# Altium schematic sheet MAZ000171 - Diagrama eléctrico.SchDoc: MAZ000171 - Diagrama eléctrico
size A; ApprovedBy: Christian Ledwidth; CheckedBy: Nahuel Martinez; Author: Santiago Marti; CompanyName: Body Health; DrawnBy: Santiago Marti; Revision: A; SheetNumber: 1; SheetTotal: 2
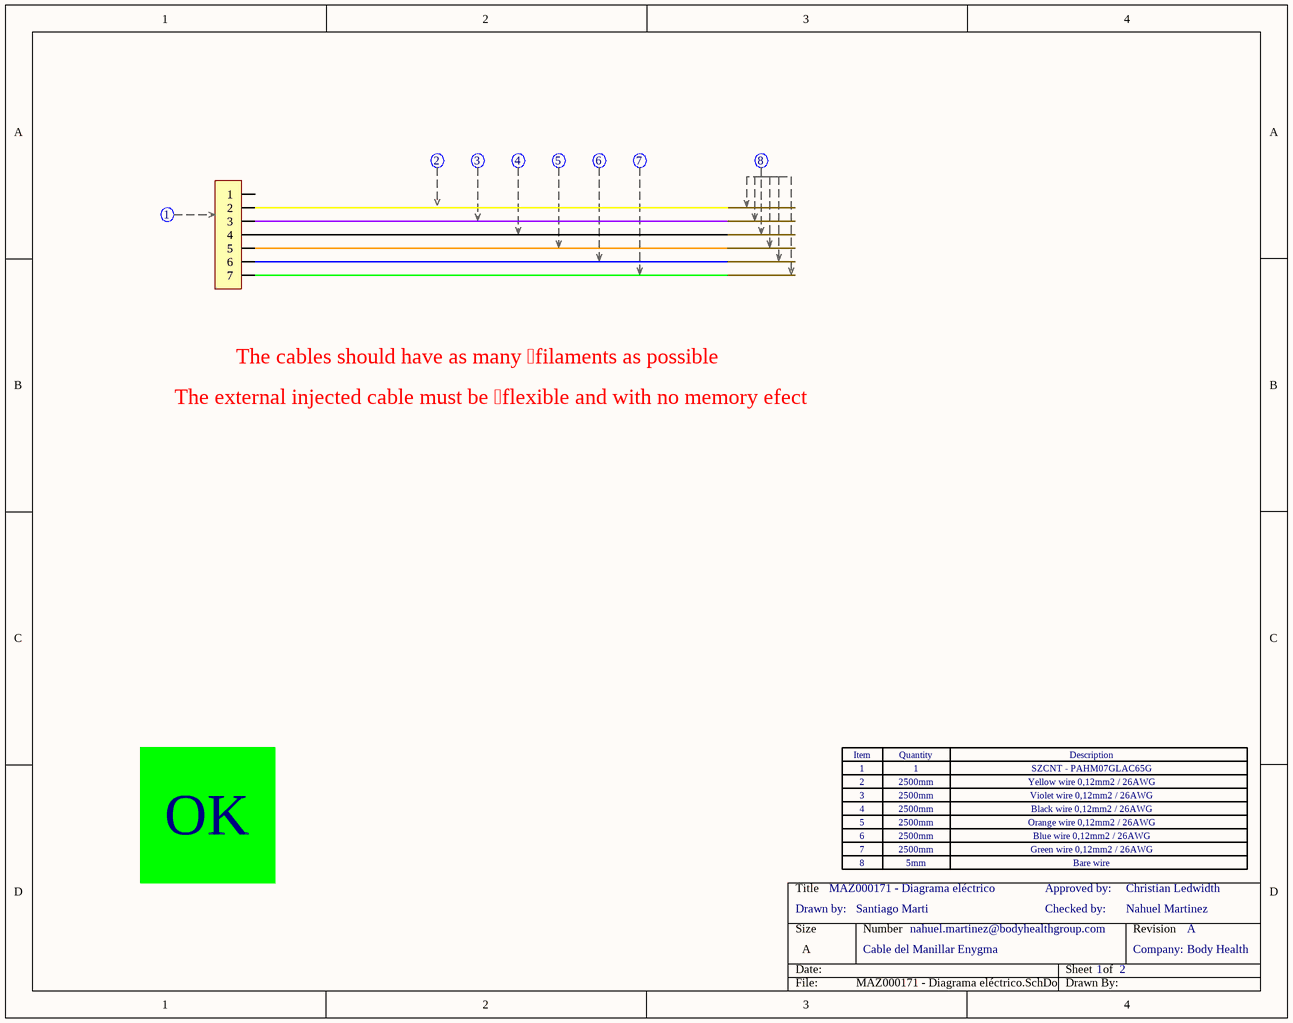
[diagram p0: MAZ000171 - Diagrama eléctrico.SchDoc]

## Parts
Conn1  SZCNT_07_Macho  (value not drawn)  (part C of 3)
Conn2  SZCNT_07_Macho  (value not drawn)  (part B of 3)
Conn3  SZCNT_07_Macho  (value not drawn)  (part B of 3)
Conn4  SZCNT_07_Macho  (value not drawn)  (part B of 3)
Conn5  SZCNT_07_Macho  (value not drawn)  (part B of 3)
Conn6  SZCNT_07_Macho  (value not drawn)  (part B of 3)
Conn7  SZCNT_07_Macho  (value not drawn)  (part B of 3)
Conn8  SZCNT_07_Macho  (value not drawn)  (part B of 3)
Conn9  SZCNT_07_Macho  (value not drawn)  (part B of 3)
Zoc1  Zócalo_Header  (value not drawn)
Zoc2  Zócalo_Item  (value not drawn)
Zoc3  Zócalo_Item  (value not drawn)
Zoc4  Zócalo_Item  (value not drawn)
Zoc5  Zócalo_Item  (value not drawn)
Zoc6  Zócalo_Item  (value not drawn)
Zoc7  Zócalo_Item  (value not drawn)
Zoc8  Zócalo_Item  (value not drawn)
Zoc9  Zócalo_Item  (value not drawn)

## Nets

Not connected (* = marked no-connect by the designer): Conn1 1 2 3 4 5 6 7

## Notes on the sheet
- The cables should have as many filaments as possible
- The external injected cable must be flexible and with no memory efect
- 1
- 2
- 2500mm
- SZCNT - PAHM07GLAC65G
- Yellow wire 0,12mm2 / 26AWG
- OK
- 3
- 4
- 5
- 6
- Violet wire 0,12mm2 / 26AWG
- Black wire 0,12mm2 / 26AWG
- Orange wire 0,12mm2 / 26AWG
- Blue wire 0,12mm2 / 26AWG
- Drawn by:
- 7
- 8
- 5mm
- Checked by:
- Approved by:
- Green wire 0,12mm2 / 26AWG
- Bare wire
- Cable del Manillar Enygma
- nahuel.martinez@bodyhealthgroup.com
- Company:
- (in symbol Zócalo_Header) Item; Quantity; Description

## Library data of the parts
Conn1 = SZCNT_07_Macho: Conector SZCNT 7 vías macho para cable; Cod.DigiKey: Se compra a SZCNT; Cod.Fabricante: *; ComponentLink1Description: Manufacturer Link; ComponentLink1URL: *; DIGIKEYx100: *; Fabricante: SZCNT; CallOut: *; DIGIKEYx50: *
Conn2 = SZCNT_07_Macho: Conector SZCNT 7 vías macho para cable; CallOut: 2; Cod.DigiKey: Se compra a SZCNT; Cod.Fabricante: *; ComponentLink1Description: Manufacturer Link; ComponentLink1URL: *; DIGIKEYx100: *; Fabricante: SZCNT; DIGIKEYx50: *
Conn3 = SZCNT_07_Macho: Conector SZCNT 7 vías macho para cable; CallOut: 3; Cod.DigiKey: Se compra a SZCNT; Cod.Fabricante: *; ComponentLink1Description: Manufacturer Link; ComponentLink1URL: *; DIGIKEYx100: *; Fabricante: SZCNT; DIGIKEYx50: *
Conn4 = SZCNT_07_Macho: Conector SZCNT 7 vías macho para cable; CallOut: 4; Cod.DigiKey: Se compra a SZCNT; Cod.Fabricante: *; ComponentLink1Description: Manufacturer Link; ComponentLink1URL: *; DIGIKEYx100: *; Fabricante: SZCNT; DIGIKEYx50: *
Conn5 = SZCNT_07_Macho: Conector SZCNT 7 vías macho para cable; CallOut: 5; Cod.DigiKey: Se compra a SZCNT; Cod.Fabricante: *; ComponentLink1Description: Manufacturer Link; ComponentLink1URL: *; DIGIKEYx100: *; Fabricante: SZCNT; DIGIKEYx50: *
Conn6 = SZCNT_07_Macho: Conector SZCNT 7 vías macho para cable; CallOut: 6; Cod.DigiKey: Se compra a SZCNT; Cod.Fabricante: *; ComponentLink1Description: Manufacturer Link; ComponentLink1URL: *; DIGIKEYx100: *; Fabricante: SZCNT; DIGIKEYx50: *
Conn7 = SZCNT_07_Macho: Conector SZCNT 7 vías macho para cable; CallOut: 7; Cod.DigiKey: Se compra a SZCNT; Cod.Fabricante: *; ComponentLink1Description: Manufacturer Link; ComponentLink1URL: *; DIGIKEYx100: *; Fabricante: SZCNT; DIGIKEYx50: *
Conn8 = SZCNT_07_Macho: Conector SZCNT 7 vías macho para cable; CallOut: 8; Cod.DigiKey: Se compra a SZCNT; Cod.Fabricante: *; ComponentLink1Description: Manufacturer Link; ComponentLink1URL: *; DIGIKEYx100: *; Fabricante: SZCNT; DIGIKEYx50: *
Conn9 = SZCNT_07_Macho: Conector SZCNT 7 vías macho para cable; CallOut: 1; Cod.DigiKey: Se compra a SZCNT; Cod.Fabricante: *; ComponentLink1Description: Manufacturer Link; ComponentLink1URL: *; DIGIKEYx100: *; Fabricante: SZCNT; DIGIKEYx50: *
Zoc1 = Zócalo_Header: Header para el zócalo de referencias
Zoc2-Zoc9 = Zócalo_Item: Ítem para el zócalo de referencias; Desginator: *; Quantity: *; ItemDescription: *